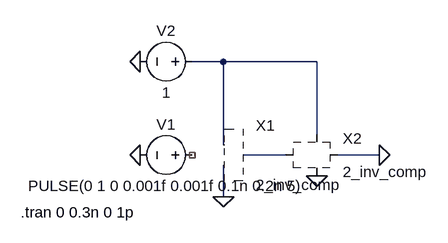
[diagram p0: schematic 2_retardo.asc]
2_retardo.asc, the LTspice schematic file:
Version 4
SHEET 1 880 680
WIRE 128 -80 80 -80
WIRE 272 -80 128 -80
WIRE 128 32 128 -80
WIRE 272 32 272 -80
WIRE 128 48 128 32
WIRE 224 64 160 64
WIRE 368 64 304 64
WIRE 128 96 128 80
WIRE 128 128 128 96
FLAG 0 64 0
FLAG 128 128 0
FLAG 0 -80 0
FLAG 368 64 0
FLAG 272 96 0
SYMBOL voltage 96 64 R90
WINDOW 0 -32 56 VBottom 2
WINDOW 3 32 56 VTop 2
WINDOW 123 0 0 Left 2
WINDOW 39 0 0 Left 2
SYMATTR InstName V1
SYMATTR Value PULSE(0 1 0 0.001f 0.001f 0.1n 0.2n 5)
SYMBOL 2_inv_comp 128 64 R0
SYMATTR InstName X1
SYMBOL 2_inv_comp 272 64 R0
SYMATTR InstName X2
SYMBOL voltage 96 -80 R90
WINDOW 0 -32 56 VBottom 2
WINDOW 3 32 56 VTop 2
SYMATTR InstName V2
SYMATTR Value 1
TEXT -184 152 Left 2 !.tran 0 0.3n 0 1p

The netlist it stands for:
* 2_retardo.asc
V1 NC_01 0 PULSE(0 1 0 0.001f 0.001f 0.1n 0.2n 5)
* X1: 2_inv_comp (symbol 2_inv_comp not available, pin order unknown); nets seen at it: 0, N001, N002
* X2: 2_inv_comp (symbol 2_inv_comp not available, pin order unknown); nets seen at it: 0, N001, N002
V2 N001 0 1
.tran 0 0.3n 0 1p
.backanno
.end